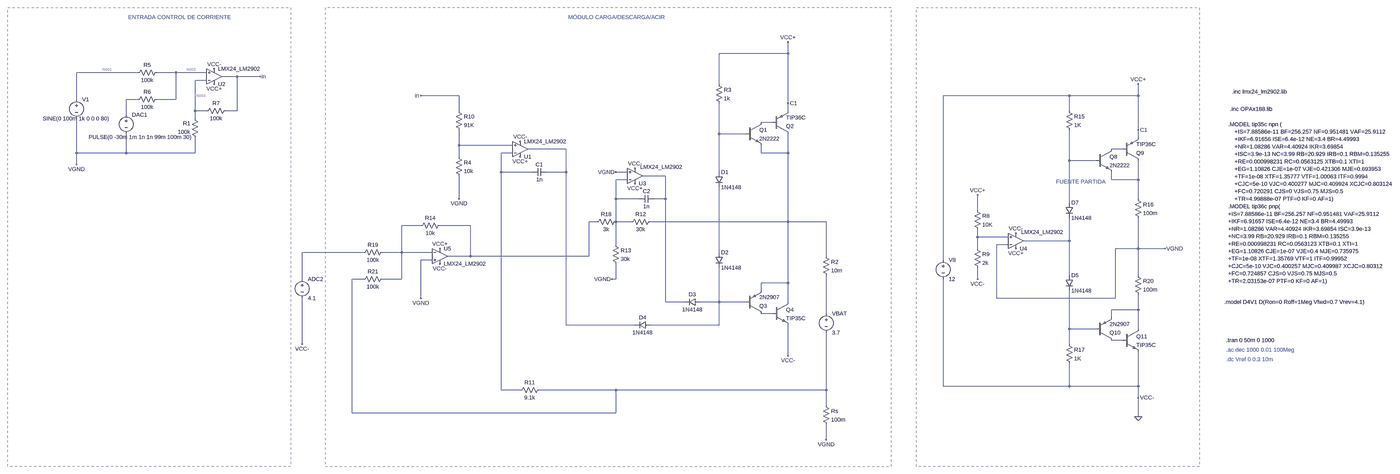
[diagram p0: schematic modulo_carga_descarga_ac_imp_alt.asc, whole sheet]
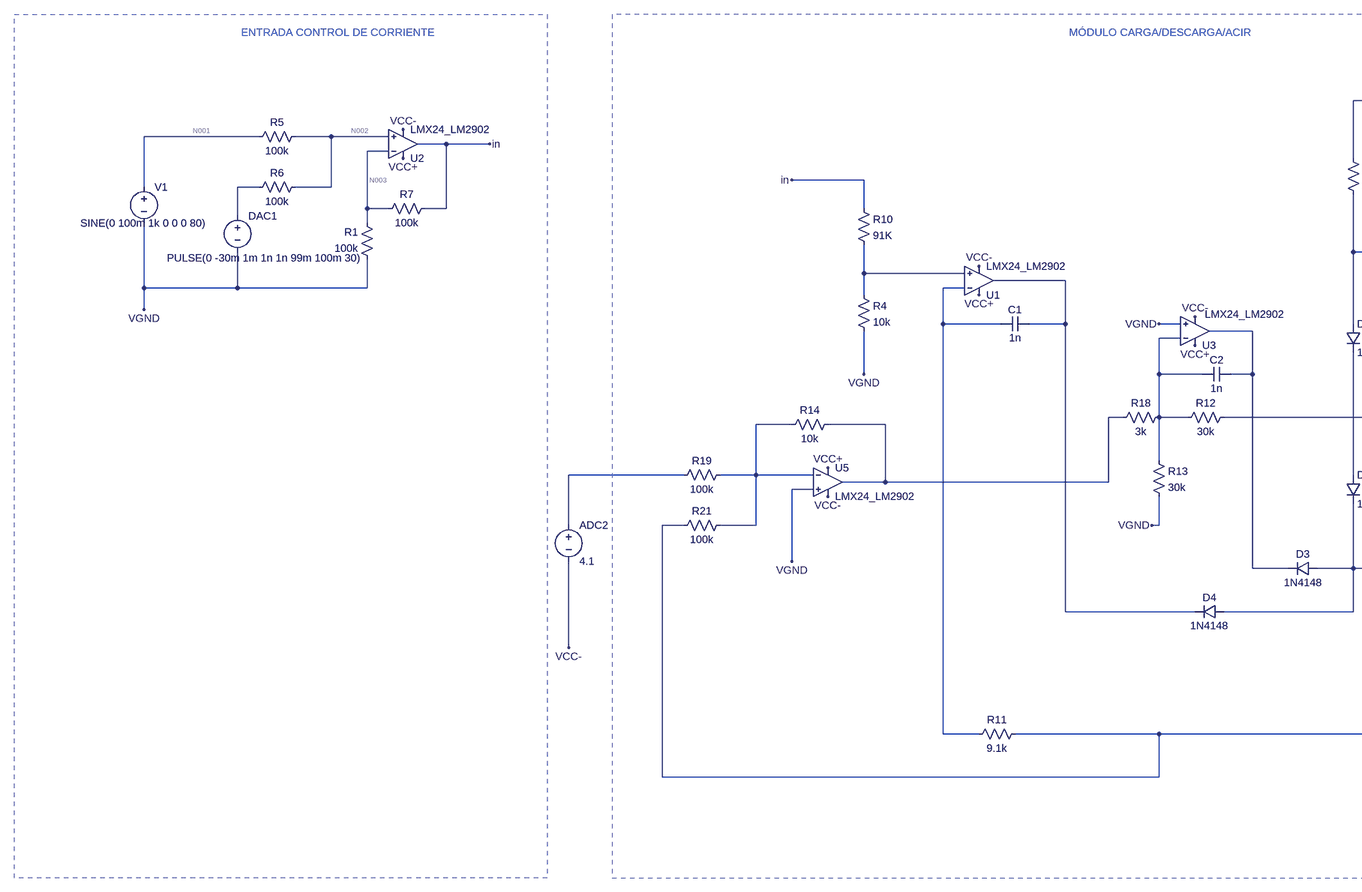
[diagram p1: schematic modulo_carga_descarga_ac_imp_alt.asc, part, row 1 of 1, column 1 of 2]
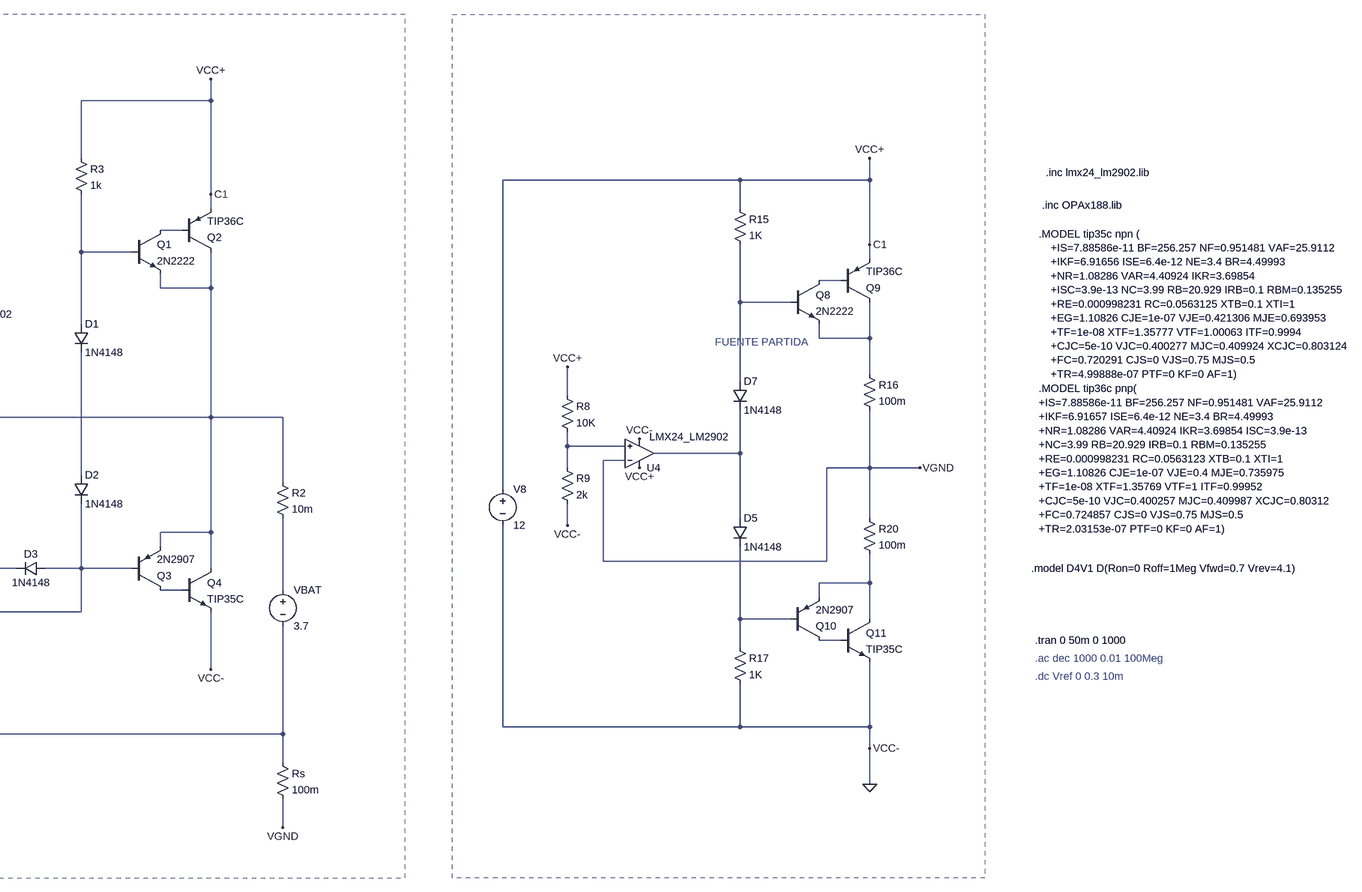
[diagram p2: schematic modulo_carga_descarga_ac_imp_alt.asc, part, row 1 of 1, column 2 of 2]
modulo_carga_descarga_ac_imp_alt.asc, the LTspice schematic file:
Version 4.1
SHEET 1 4748 1780
WIRE 1280 -1056 1280 -1104
WIRE 1280 -1056 992 -1056
WIRE -1440 -976 -1696 -976
WIRE -1280 -976 -1360 -976
WIRE -1152 -976 -1280 -976
WIRE -1024 -960 -1088 -960
WIRE -928 -960 -1024 -960
WIRE -1152 -944 -1200 -944
WIRE 992 -928 992 -1056
WIRE -96 -880 -256 -880
WIRE 2512 -880 1984 -880
WIRE 2800 -880 2800 -928
WIRE 2800 -880 2512 -880
WIRE -1696 -864 -1696 -976
WIRE -1440 -864 -1488 -864
WIRE -1280 -864 -1280 -976
WIRE -1280 -864 -1360 -864
WIRE 1280 -848 1280 -1056
WIRE -1200 -816 -1200 -944
WIRE -1152 -816 -1200 -816
WIRE -1024 -816 -1024 -960
WIRE -1024 -816 -1072 -816
WIRE -96 -816 -96 -880
WIRE 1280 -816 1280 -848
WIRE 2512 -816 2512 -880
WIRE -1488 -800 -1488 -864
WIRE -1200 -784 -1200 -816
WIRE 1216 -768 1168 -768
WIRE 2800 -736 2800 -880
WIRE 992 -720 992 -848
WIRE 1104 -720 992 -720
WIRE 2800 -704 2800 -736
WIRE -96 -672 -96 -736
WIRE 128 -672 -96 -672
WIRE 352 -656 192 -656
WIRE 2736 -656 2688 -656
WIRE -1696 -640 -1696 -784
WIRE -1488 -640 -1488 -720
WIRE -1488 -640 -1696 -640
WIRE -1200 -640 -1200 -704
WIRE -1200 -640 -1488 -640
WIRE 128 -640 80 -640
WIRE 1168 -640 1168 -672
WIRE 1280 -640 1280 -720
WIRE 1280 -640 1168 -640
WIRE -96 -624 -96 -672
WIRE 2512 -608 2512 -736
WIRE 2624 -608 2512 -608
WIRE -1696 -592 -1696 -640
WIRE 80 -560 80 -640
WIRE 208 -560 80 -560
WIRE 352 -560 352 -656
WIRE 352 -560 272 -560
WIRE 608 -560 560 -560
WIRE 992 -560 992 -720
WIRE 768 -544 672 -544
WIRE 608 -528 560 -528
WIRE 2688 -528 2688 -560
WIRE 2800 -528 2800 -608
WIRE 2800 -528 2688 -528
WIRE -96 -448 -96 -544
WIRE 560 -448 560 -528
WIRE 656 -448 560 -448
WIRE 768 -448 768 -544
WIRE 768 -448 720 -448
WIRE 2800 -448 2800 -528
WIRE 2512 -432 2512 -608
WIRE 2128 -400 2128 -464
WIRE 480 -352 448 -352
WIRE 560 -352 560 -448
WIRE 624 -352 560 -352
WIRE 1280 -352 1280 -640
WIRE 1280 -352 704 -352
WIRE 1440 -352 1280 -352
WIRE -256 -336 -336 -336
WIRE -48 -336 -176 -336
WIRE 2128 -288 2128 -320
WIRE 2256 -288 2128 -288
WIRE 2512 -272 2512 -368
WIRE 2512 -272 2320 -272
WIRE 560 -256 560 -352
WIRE 2256 -256 2208 -256
WIRE 2128 -240 2128 -288
WIRE 2800 -240 2800 -368
WIRE 2800 -240 2704 -240
WIRE 2912 -240 2800 -240
WIRE -496 -224 -752 -224
WIRE -336 -224 -336 -336
WIRE -336 -224 -416 -224
WIRE -208 -224 -336 -224
WIRE 992 -224 992 -496
WIRE -48 -208 -48 -336
WIRE -48 -208 -144 -208
WIRE 448 -208 448 -352
WIRE 448 -208 -48 -208
WIRE 1440 -208 1440 -352
WIRE -208 -192 -256 -192
WIRE 1984 -192 1984 -880
WIRE 2512 -128 2512 -272
WIRE 2800 -128 2800 -240
WIRE -752 -112 -752 -224
WIRE -496 -112 -544 -112
WIRE -336 -112 -336 -224
WIRE -336 -112 -416 -112
WIRE 560 -112 560 -176
WIRE 560 -112 544 -112
WIRE 2128 -112 2128 -160
WIRE 1280 -96 1280 -352
WIRE 1280 -96 1168 -96
WIRE 1168 -64 1168 -96
WIRE -256 -32 -256 -192
WIRE 2208 -32 2208 -256
WIRE 2704 -32 2704 -240
WIRE 2704 -32 2208 -32
WIRE 768 -16 768 -448
WIRE 848 -16 768 -16
WIRE 992 -16 992 -160
WIRE 992 -16 912 -16
WIRE 1104 -16 992 -16
WIRE 1280 -16 1280 -96
WIRE 2800 16 2800 -48
WIRE 2800 16 2688 16
WIRE 1216 32 1168 32
WIRE 1440 32 1440 -128
WIRE 2688 48 2688 16
WIRE 352 80 352 -560
WIRE 640 80 352 80
WIRE 992 80 992 -16
WIRE 992 80 704 80
WIRE 2512 96 2512 -64
WIRE 2624 96 2512 96
WIRE 2800 96 2800 16
WIRE 2736 144 2688 144
WIRE -752 160 -752 -32
WIRE 2512 160 2512 96
WIRE 1280 208 1280 80
WIRE 1984 336 1984 -112
WIRE 2512 336 2512 240
WIRE 2512 336 1984 336
WIRE 2800 336 2800 192
WIRE 2800 336 2512 336
WIRE 80 352 80 -560
WIRE 160 352 80 352
WIRE 560 352 240 352
WIRE 1440 352 1440 112
WIRE 1440 352 560 352
WIRE 2800 384 2800 336
WIRE 1440 416 1440 352
WIRE -544 448 -544 -112
WIRE 560 448 560 352
WIRE 560 448 -544 448
WIRE 2800 464 2800 384
WIRE 1440 560 1440 496
FLAG 160 -624 VCC+
FLAG 1280 -848 C1
FLAG 160 -688 VCC-
FLAG 640 -512 VCC+
FLAG 640 -576 VCC-
FLAG 1280 -1104 VCC+
FLAG 1280 208 VCC-
FLAG 1440 560 VGND
FLAG 2800 -736 C1
FLAG 2800 -928 VCC+
FLAG 2800 384 VCC-
FLAG 2912 -240 VGND
FLAG 2800 464 0
FLAG -96 -448 VGND
FLAG -1120 -928 VCC+
FLAG -1120 -992 VCC-
FLAG -1696 -592 VGND
FLAG -928 -960 in
FLAG -256 -880 in
FLAG 2288 -240 VCC+
FLAG 2288 -304 VCC-
FLAG 2128 -464 VCC+
FLAG 2128 -112 VCC-
FLAG -176 -240 VCC+
FLAG -176 -176 VCC-
FLAG -752 160 VCC-
FLAG -256 -32 VGND
FLAG 560 -560 VGND
FLAG 544 -112 VGND
SYMBOL res 1424 400 R0
SYMATTR InstName Rs
SYMATTR Value 100m
SYMBOL npn 1104 -768 R0
SYMATTR InstName Q1
SYMATTR Value 2N2222
SYMBOL pnp 1216 -720 M180
SYMATTR InstName Q2
SYMATTR Value TIP36C
SYMBOL pnp 1104 32 M180
SYMATTR InstName Q3
SYMATTR Value 2N2907
SYMBOL npn 1216 -16 R0
SYMATTR InstName Q4
SYMATTR Value TIP35C
SYMBOL voltage 1440 16 R0
WINDOW 123 0 0 Left 0
WINDOW 39 0 0 Left 0
SYMATTR InstName VBAT
SYMATTR Value 3.7
SYMBOL res -112 -640 R0
SYMATTR InstName R4
SYMATTR Value 10k
SYMBOL res -112 -832 R0
SYMATTR InstName R10
SYMATTR Value 91K
SYMBOL diode 976 -224 R0
SYMATTR InstName D2
SYMATTR Value 1N4148
SYMBOL res 976 -944 R0
SYMATTR InstName R3
SYMATTR Value 1k
SYMBOL OpAmps\\opamp2 160 -592 M180
SYMATTR InstName U1
SYMATTR Value LMX24_LM2902
SYMBOL cap 272 -576 R90
WINDOW 0 0 32 VBottom 2
WINDOW 3 32 32 VTop 2
SYMATTR InstName C1
SYMATTR Value 1n
SYMBOL res 256 336 R90
WINDOW 0 0 56 VBottom 2
WINDOW 3 32 56 VTop 2
SYMATTR InstName R11
SYMATTR Value 9.1k
SYMBOL diode 912 -32 R90
WINDOW 0 0 32 VBottom 2
WINDOW 3 32 32 VTop 2
SYMATTR InstName D3
SYMATTR Value 1N4148
SYMBOL OpAmps\\opamp2 640 -480 M180
WINDOW 3 22 101 Left 2
SYMATTR Value LMX24_LM2902
SYMATTR InstName U3
SYMBOL cap 720 -464 R90
WINDOW 0 0 32 VBottom 2
WINDOW 3 32 32 VTop 2
SYMATTR InstName C2
SYMATTR Value 1n
SYMBOL voltage -752 -128 R0
WINDOW 123 0 0 Left 0
WINDOW 39 0 0 Left 0
SYMATTR InstName ADC2
SYMATTR Value 4.1
SYMBOL res 544 -272 R0
SYMATTR InstName R13
SYMATTR Value 30k
SYMBOL res 720 -368 R90
WINDOW 0 0 56 VBottom 2
WINDOW 3 32 56 VTop 2
SYMATTR InstName R12
SYMATTR Value 30k
SYMBOL diode 976 -560 R0
SYMATTR InstName D1
SYMATTR Value 1N4148
SYMBOL diode 704 64 R90
WINDOW 0 0 32 VBottom 2
WINDOW 3 32 32 VTop 2
SYMATTR InstName D4
SYMATTR Value 1N4148
SYMBOL voltage 1984 -208 R0
WINDOW 123 0 0 Left 0
WINDOW 39 0 0 Left 0
SYMATTR InstName V8
SYMATTR Value 12
SYMBOL npn 2624 -656 R0
SYMATTR InstName Q8
SYMATTR Value 2N2222
SYMBOL pnp 2736 -608 M180
SYMATTR InstName Q9
SYMATTR Value TIP36C
SYMBOL pnp 2624 144 M180
SYMATTR InstName Q10
SYMATTR Value 2N2907
SYMBOL npn 2736 96 R0
SYMATTR InstName Q11
SYMATTR Value TIP35C
SYMBOL diode 2496 -128 R0
SYMATTR InstName D5
SYMATTR Value 1N4148
SYMBOL res 2496 -832 R0
SYMATTR InstName R15
SYMATTR Value 1K
SYMBOL diode 2496 -432 R0
SYMATTR InstName D7
SYMATTR Value 1N4148
SYMBOL res 2784 -464 R0
SYMATTR InstName R16
SYMATTR Value 100m
SYMBOL res 2496 144 R0
SYMATTR InstName R17
SYMATTR Value 1K
SYMBOL res 2784 -144 R0
SYMATTR InstName R20
SYMATTR Value 100m
SYMBOL res 1424 -224 R0
SYMATTR InstName R2
SYMATTR Value 10m
SYMBOL OpAmps\\opamp2 -1120 -896 M180
SYMATTR InstName U2
SYMATTR Value LMX24_LM2902
SYMBOL res -1184 -688 R180
WINDOW 0 36 76 Left 2
WINDOW 3 36 40 Left 2
SYMATTR InstName R1
SYMATTR Value 100k
SYMBOL res -1344 -992 R90
WINDOW 0 0 56 VBottom 2
WINDOW 3 32 56 VTop 2
SYMATTR InstName R5
SYMATTR Value 100k
SYMBOL res -1344 -880 R90
WINDOW 0 0 56 VBottom 2
WINDOW 3 32 56 VTop 2
SYMATTR InstName R6
SYMATTR Value 100k
SYMBOL voltage -1488 -816 R0
WINDOW 3 -157 110 Left 2
WINDOW 123 0 0 Left 0
WINDOW 39 0 0 Left 0
SYMATTR Value PULSE(0 -30m 1m 1n 1n 99m 100m 30)
SYMATTR InstName DAC1
SYMBOL res -1056 -832 R90
WINDOW 0 0 56 VBottom 2
WINDOW 3 32 56 VTop 2
SYMATTR InstName R7
SYMATTR Value 100k
SYMBOL OpAmps\\opamp2 2288 -208 M180
WINDOW 3 22 101 Left 2
SYMATTR Value LMX24_LM2902
SYMATTR InstName U4
SYMBOL res 2112 -416 R0
SYMATTR InstName R8
SYMATTR Value 10K
SYMBOL res 2112 -256 R0
SYMATTR InstName R9
SYMATTR Value 2k
SYMBOL voltage -1696 -880 R0
WINDOW 3 -141 96 Left 2
WINDOW 123 0 0 Left 0
WINDOW 39 0 0 Left 0
SYMATTR Value SINE(0 100m 1k 0 0 0 80)
SYMATTR InstName V1
SYMBOL OpAmps\\opamp2 -176 -272 R0
SYMATTR InstName U5
SYMATTR Value LMX24_LM2902
SYMBOL res -400 -240 R90
WINDOW 0 0 56 VBottom 2
WINDOW 3 32 56 VTop 2
SYMATTR InstName R19
SYMATTR Value 100k
SYMBOL res -400 -128 R90
WINDOW 0 0 56 VBottom 2
WINDOW 3 32 56 VTop 2
SYMATTR InstName R21
SYMATTR Value 100k
SYMBOL res -160 -352 R90
WINDOW 0 0 56 VBottom 2
WINDOW 3 32 56 VTop 2
SYMATTR InstName R14
SYMATTR Value 10k
SYMBOL res 576 -368 R90
WINDOW 0 0 56 VBottom 2
WINDOW 3 32 56 VTop 2
SYMATTR InstName R18
SYMATTR Value 3k
TEXT 3296 144 Left 2 !.tran 0 50m 0 1000
TEXT 3296 184 Left 2 ;.ac dec 1000 0.01 100Meg
TEXT 3296 224 Left 2 ;.dc Vref 0 0.3 10m
TEXT 3304 -760 Left 2 !.MODEL tip35c npn (\n    +IS=7.88586e-11 BF=256.257 NF=0.951481 VAF=25.9112\n    +IKF=6.91656 ISE=6.4e-12 NE=3.4 BR=4.49993\n    +NR=1.08286 VAR=4.40924 IKR=3.69854\n    +ISC=3.9e-13 NC=3.99 RB=20.929 IRB=0.1 RBM=0.135255\n    +RE=0.000998231 RC=0.0563125 XTB=0.1 XTI=1\n    +EG=1.10826 CJE=1e-07 VJE=0.421306 MJE=0.693953\n    +TF=1e-08 XTF=1.35777 VTF=1.00063 ITF=0.9994\n    +CJC=5e-10 VJC=0.400277 MJC=0.409924 XCJC=0.803124\n    +FC=0.720291 CJS=0 VJS=0.75 MJS=0.5\n    +TR=4.99888e-07 PTF=0 KF=0 AF=1)
TEXT 3304 -416 Left 2 !.MODEL tip36c pnp(\n+IS=7.88586e-11 BF=256.257 NF=0.951481 VAF=25.9112\n+IKF=6.91657 ISE=6.4e-12 NE=3.4 BR=4.49993\n+NR=1.08286 VAR=4.40924 IKR=3.69854 ISC=3.9e-13\n+NC=3.99 RB=20.929 IRB=0.1 RBM=0.135255\n+RE=0.000998231 RC=0.0563123 XTB=0.1 XTI=1\n+EG=1.10826 CJE=1e-07 VJE=0.4 MJE=0.735975\n+TF=1e-08 XTF=1.35769 VTF=1 ITF=0.99952\n+CJC=5e-10 VJC=0.400257 MJC=0.409987 XCJC=0.80312\n+FC=0.724857 CJS=0 VJS=0.75 MJS=0.5\n+TR=2.03153e-07 PTF=0 KF=0 AF=1)
TEXT 3312 -824 Left 2 !.inc OPAx188.lib
TEXT 3288 -16 Left 2 !.model D4V1 D(Ron=0 Roff=1Meg Vfwd=0.7 Vrev=4.1)
TEXT 3320 -896 Left 2 !.inc lmx24_lm2902.lib
TEXT 2456 -520 Left 2 ;FUENTE PARTIDA
TEXT 360 -1208 Left 2 ;MÓDULO CARGA/DESCARGA/ACIR
TEXT -1480 -1208 Left 2 ;ENTRADA CONTROL DE CORRIENTE
RECTANGLE Normal 3056 672 1872 -1248 2
RECTANGLE Normal -656 672 1712 -1248 2
RECTANGLE Normal -800 672 -1984 -1248 2

The netlist it stands for:
* modulo_carga_descarga_ac_imp_alt.asc
Rs N022 VGND 100m
Q1 N005 N006 N011 0 2N2222
Q2 N011 N005 C1 0 TIP36C
Q3 N025 N023 N011 0 2N2907
Q4 N011 N025 0 0 TIP35C
VBAT N026 N022 3.7
R4 N007 VGND 10k
R10 in N007 91K
D2 N021 N023 1N4148
R3 C1 N006 1k
X§U1 N007 N010 C1 0 N008 LMX24_LM2902  ; pins In+ In- V+ V- OUT
C1 N008 N010 1n
R11 N022 N010 9.1k
D3 N023 N013 1N4148
X§U3 VGND N014 C1 0 N013 LMX24_LM2902  ; pins In+ In- V+ V- OUT
C2 N013 N014 1n
V§ADC2 N020 0 4.1
R13 N014 VGND 30k
R12 N011 N014 30k
D1 N006 N021 1N4148
D4 N023 N008 1N4148
V8 C1 0 12
Q8 N009 N012 N015 0 2N2222
Q9 N015 N009 C1 0 TIP36C
Q10 N028 N027 N024 0 2N2907
Q11 N024 N028 0 0 TIP35C
D5 N019 N027 1N4148
R15 C1 N012 1K
D7 N012 N019 1N4148
R16 N015 VGND 100m
R17 N027 0 1K
R20 VGND N024 100m
R2 N011 N026 10m
X§U2 N002 N003 C1 0 in LMX24_LM2902  ; pins In+ In- V+ V- OUT
R1 VGND N003 100k
R5 N002 N001 100k
R6 N002 N004 100k
V§DAC1 N004 VGND PULSE(0 -30m 1m 1n 1n 99m 100m 30)
R7 in N003 100k
X§U4 N018 VGND C1 0 N019 LMX24_LM2902  ; pins In+ In- V+ V- OUT
R8 C1 N018 10K
R9 N018 0 2k
V1 N001 VGND SINE(0 100m 1k 0 0 0 80)
X§U5 VGND N017 C1 0 N016 LMX24_LM2902  ; pins In+ In- V+ V- OUT
R19 N017 N020 100k
R21 N017 N022 100k
R14 N016 N017 10k
R18 N014 N016 3k
.model D D
.lib standard.dio
.model NPN NPN
.model PNP PNP
.lib standard.bjt
.tran 0 50m 0 1000
* .ac dec 1000 0.01 100Meg
* .dc Vref 0 0.3 10m
.MODEL tip35c npn (
    +IS=7.88586e-11 BF=256.257 NF=0.951481 VAF=25.9112
    +IKF=6.91656 ISE=6.4e-12 NE=3.4 BR=4.49993
    +NR=1.08286 VAR=4.40924 IKR=3.69854
    +ISC=3.9e-13 NC=3.99 RB=20.929 IRB=0.1 RBM=0.135255
    +RE=0.000998231 RC=0.0563125 XTB=0.1 XTI=1
    +EG=1.10826 CJE=1e-07 VJE=0.421306 MJE=0.693953
    +TF=1e-08 XTF=1.35777 VTF=1.00063 ITF=0.9994
    +CJC=5e-10 VJC=0.400277 MJC=0.409924 XCJC=0.803124
    +FC=0.720291 CJS=0 VJS=0.75 MJS=0.5
    +TR=4.99888e-07 PTF=0 KF=0 AF=1)
.MODEL tip36c pnp(
+IS=7.88586e-11 BF=256.257 NF=0.951481 VAF=25.9112
+IKF=6.91657 ISE=6.4e-12 NE=3.4 BR=4.49993
+NR=1.08286 VAR=4.40924 IKR=3.69854 ISC=3.9e-13
+NC=3.99 RB=20.929 IRB=0.1 RBM=0.135255
+RE=0.000998231 RC=0.0563123 XTB=0.1 XTI=1
+EG=1.10826 CJE=1e-07 VJE=0.4 MJE=0.735975
+TF=1e-08 XTF=1.35769 VTF=1 ITF=0.99952
+CJC=5e-10 VJC=0.400257 MJC=0.409987 XCJC=0.80312
+FC=0.724857 CJS=0 VJS=0.75 MJS=0.5
+TR=2.03153e-07 PTF=0 KF=0 AF=1)
.inc OPAx188.lib
.model D4V1 D(Ron=0 Roff=1Meg Vfwd=0.7 Vrev=4.1)
.inc lmx24_lm2902.lib
* FUENTE PARTIDA
* MÓDULO CARGA/DESCARGA/ACIR
* ENTRADA CONTROL DE CORRIENTE
.backanno
.end

* Results of the author's LTspice run, read from the files saved beside the schematic
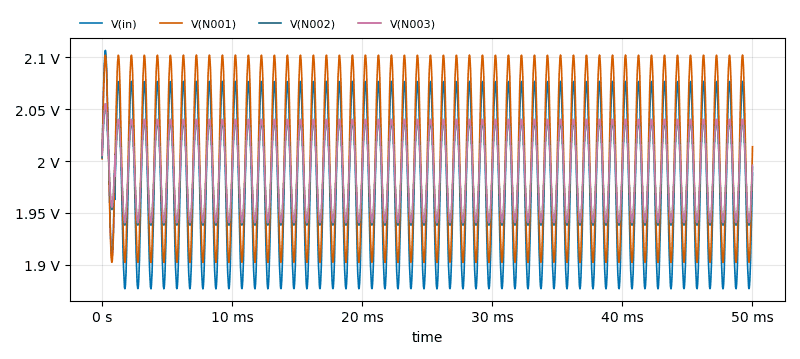
[diagram p3: Transient Analysis of modulo_carga_descarga_ac_imp_alt.asc, plotted from the saved traces]
* Transient Analysis, 1 run:
*   V(in): min 1.877 V, max 2.107 V, average 1.977 V, rms 1.979 V, last 1.988 V
*   V(N001): min 1.902 V, max 2.102 V, average 2.002 V, rms 2.003 V, last 2.014 V
*   V(N002): min 1.938 V, max 2.053 V, average 1.989 V, rms 1.989 V, last 1.994 V
*   V(N003): min 1.94 V, max 2.055 V, average 1.991 V, rms 1.991 V, last 1.996 V